# Altium schematic sheet CPU_PCB.SchDoc: CPU
size A4; Organization: FER; Address1: Unska 3; Address2: 10000 Zagreb; Address3: Croatia; SheetNumber: 3; SheetTotal: 4
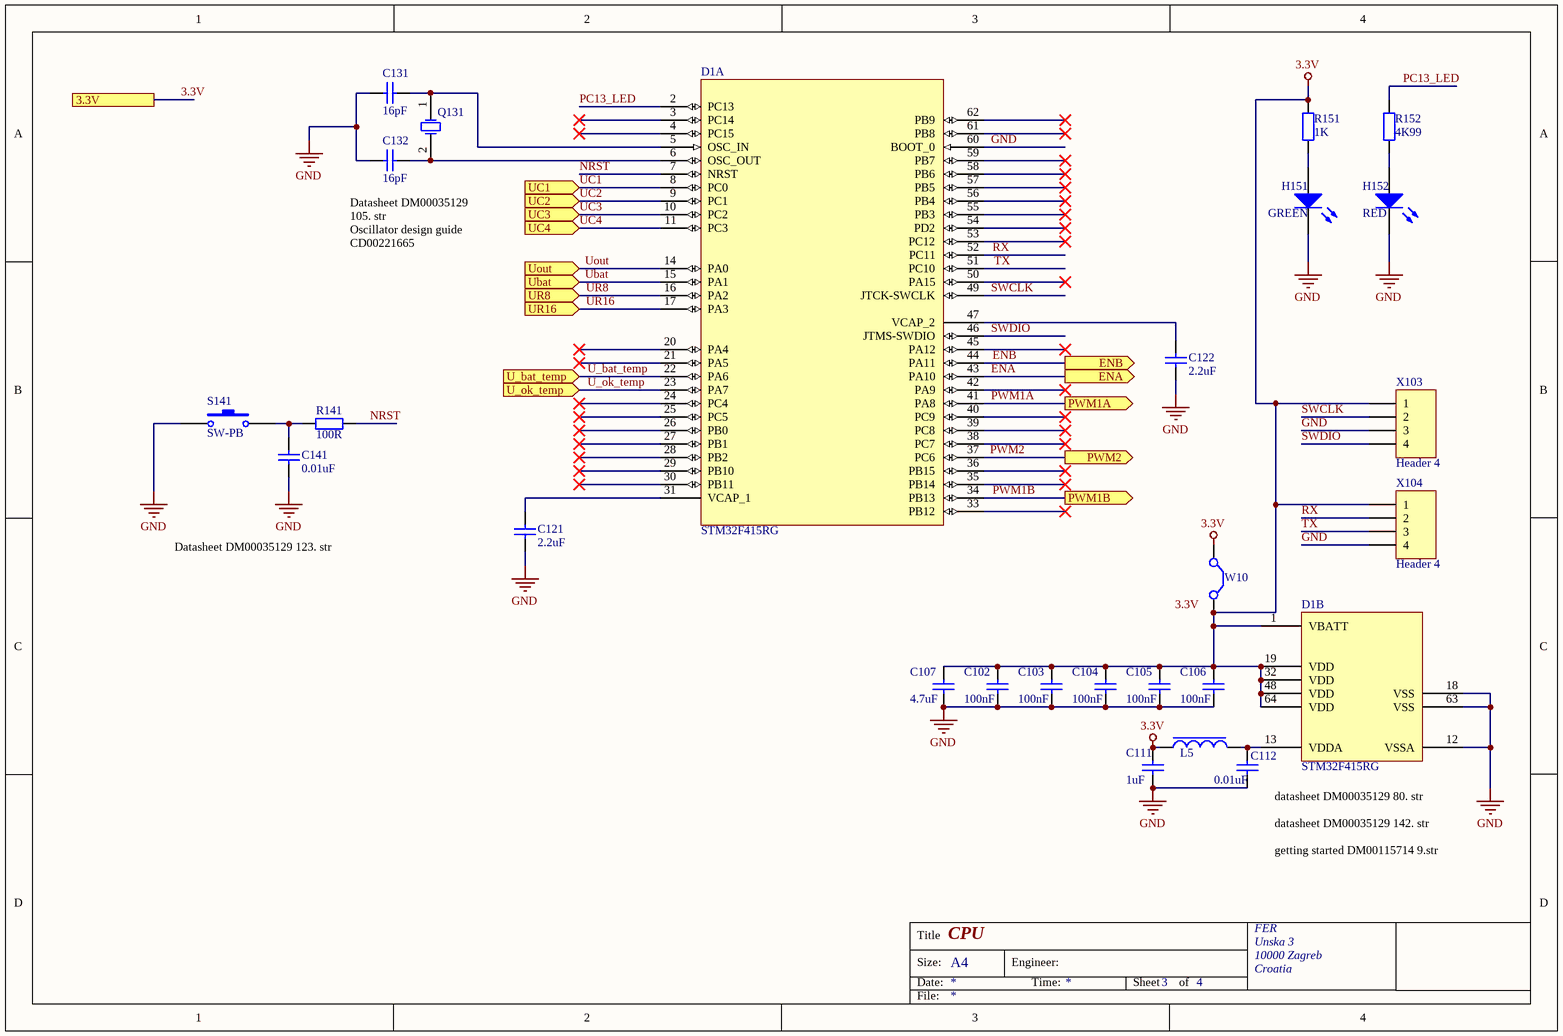
[diagram p0: CPU_PCB.SchDoc]

## Parts
C102  100nF  [CAP_0805]
C103  100nF  [CAP_0805]
C104  100nF  [CAP_0805]
C105  100nF  [CAP_0805]
C106  100nF  [CAP_0805]
C107  4.7uF  [CAP_0805]
C111  1uF  [CAP_0805]
C112  0.01uF  [CAP_0603]
C121  2.2uF  [CAP_0805]
C122  2.2uF  [CAP_0805]
C131  16pF  [CAP_0603]
C132  16pF  [CAP_0603]
C141  0.01uF  [CAP_0603]
D1  STM32F415RG  [LQFP64]  (parts A,B of 2)
H151  GREEN  [LED 1.25X2 SMD]
H152  RED  [LED 1.25X2 SMD]
L5  Inductor  [C0805]  (value not drawn)
Q131  XTAL  [QUARTZ_SMD_16MHZ]  (value not drawn)
R141  100R  [RES_0805]
R151  1K  [RES_0603]
R152  4K99  [RES_0805]
S141  SW-PB  [SWITCH KSEK43GLFS]
W10  Jumper  [HDR1X2]  (value not drawn)
X103  Header 4  [HEADER-4_PIN]
X104  Header 4  [HEADER-4_PIN]

## Ports
3.3V, ENA (out), ENB (out), PWM1A (out), PWM1B (out), PWM2 (out), U_bat_temp (in), U_ok_temp (in), Ubat (in), UC1 (in), UC2 (in), UC3 (in), UC4 (in), Uout (in), UR8 (in), UR16 (in)

## Nets
3.3V: C102.2 C103.2 C104.2 C105.2 C106.2 C107.2 C111.2 D1.1(VBATT) D1.19(VDD) D1.32(VDD) D1.48(VDD) D1.64(VDD) L5.1 R151.2 W10.1(C1) W10.2(C2) X103.1 X104.1 ; port 3.3V
GND: C102.1 C103.1 C104.1 C105.1 C106.1 C107.1 C111.1 C112.1 C121.1 C122.1 C131.2 C132.2 C141.1 D1.12(VSSA) D1.18(VSS) D1.60(BOOT_0) D1.63(VSS) H151.2(K) H152.2(K) S141.2 X103.3 X104.4
ENA: D1.43(PA10) ; port ENA
ENB: D1.44(PA11) ; port ENB
NRST: D1.7(NRST) R141.1
PC13_LED: D1.2(PC13) R152.2
PWM1A: D1.41(PA8) ; port PWM1A
PWM1B: D1.34(PB13) ; port PWM1B
PWM2: D1.37(PC6) ; port PWM2
RX: D1.52(PC11) X104.2
SWCLK: D1.49(JTCK-SWCLK) X103.2
SWDIO: D1.46(JTMS-SWDIO) X103.4
TX: D1.51(PC10) X104.3
U_bat_temp: D1.22(PA6) ; port U_bat_temp
U_ok_temp: D1.23(PA7) ; port U_ok_temp
Ubat: D1.15(PA1) ; port Ubat
UC1: D1.8(PC0) ; port UC1
UC2: D1.9(PC1) ; port UC2
UC3: D1.10(PC2) ; port UC3
UC4: D1.11(PC3) ; port UC4
Uout: D1.14(PA0) ; port Uout
UR8: D1.16(PA2) ; port UR8
UR16: D1.17(PA3) ; port UR16
NetC112_2: C112.2 D1.13(VDDA) L5.2
NetC121_2: C121.2 D1.31(VCAP_1)
NetC122_2: C122.2 D1.47(VCAP_2)
NetC131_1: C131.1 D1.5(OSC_IN) Q131.1(OSC1)
NetC132_1: C132.1 D1.6(OSC_OUT) Q131.2(OSC2)
NetC141_2: C141.2 R141.2 S141.1
NetH151_1: H151.1(A) R151.1
NetH152_1: H152.1(A) R152.1

Not connected (* = marked no-connect by the designer): D1 3(PC14)* 4(PC15)* 20(PA4)* 21(PA5)* 24(PC4)* 25(PC5)* 26(PB0)* 27(PB1)* 28(PB2)* 29(PB10)* 30(PB11)* 33(PB12)* 35(PB14)* 36(PB15)* 38(PC7)* 39(PC8)* 40(PC9)* 42(PA9)* 45(PA12)* 50(PA15)* 53(PC12)* 54(PD2)* 55(PB3)* 56(PB4)* 57(PB5)* 58(PB6)* 59(PB7)* 61(PB8)* 62(PB9)*

## Notes on the sheet
- (near C132) Datasheet DM00035129 105. str
  Oscillator design guide CD00221665
- Datasheet DM00035129 123. str
- datasheet DM00035129 80. str
  datasheet DM00035129 142. str
  getting started DM00115714 9.str
- Labels drawn without touching a wire or pin: 3.3V
- Title
- Size:
- Date:
- A4
- Engineer:
- Time:
- Sheet
- of
- File:

## Library data of the parts
C102-C106 = Cap: Capacitor; cijena (funte): 0.182; dobavljač: Farnell; kataloški broj: 1856515; opis komponente: Capacitor 100nF ceramic; Value: 100nF
C107 = Cap: Capacitor; cijena (funte): 0.61; dobavljač: Farnell; kataloški broj: 2346932; opis komponente: Capacitor 4.7uF ceramic; Value: 4.7uF
C111 = Cap: Capacitor; cijena (funte): 0.0507; dobavljač: Farnell; kataloški broj: 2496946; opis komponente: Capacitor 1uF ceramic; Value: 1uF
C112 C141 = Cap: Capacitor; cijena (funte): 0.0529; dobavljač: Farnell; kataloški broj: 1709948; opis komponente: Capacitor 0.01uF ceramic; Value: 0.01uF
C121 C122 = Cap: Capacitor; cijena (funte): 0.186; dobavljač: Farnell; kataloški broj: 1845751; opis komponente: Capacitor 2.2uF ceramic; Value: 2.2uF
C131 C132 = Cap: Capacitor; cijena (funte): 0.239; dobavljač: Farnell; kataloški broj: 1885400; opis komponente: Capacitor 16pF; Value: 16pF
D1 = STM32F415RG: Processor; cijena (funte): 7.87; dobavljač: Farnell; kataloški broj: 2064370; opis komponente: STM32F415RG
H151 = LED0: Typical INFRARED GaAs LED; cijena (funte): 0.0613; dobavljač: Farnell; kataloški broj: 2463991; opis komponente: LED diode GREEN; Value: Green
H152 = LED0: Typical INFRARED GaAs LED; cijena (funte): 0.259; dobavljač: Farnell; kataloški broj: 2610416; opis komponente: LED diode red; Value: Red
L5 = Inductor: cijena (funte): 0.0859; dobavljač: Farnell; kataloški broj: 2329422; opis komponente: ferrite bead
Q131 = XTAL: Crystal Oscillator; Value: 16MHz; cijena (funte): 0.535; dobavljač: Farnell; kataloški broj: 1611806; opis komponente: oscilator
R141 = Res2: Resistor; cijena (funte): 0.01; dobavljač: Farnell; kataloški broj: 9333703; opis komponente: Resistor 100R; Value: 100R
R151 = Res2: Resistor; cijena (funte): 0.0444; dobavljač: Farnell; kataloški broj: 1469740; opis komponente: Resistor 1K, 1%; Value: 1K
R152 = Res2: Resistor; cijena (funte): 0.56; dobavljač: Farnell; kataloški broj: 2094815; opis komponente: Resistor 4K99, 0.1%; Value: 4K99
S141 = SW-PB: Switch; cijena (funte): 0.159; dobavljač: Farnell; kataloški broj: 2435308
W10 = Jumper: Jumper Wire; cijena (funte): 0.0874; dobavljač: Farnell; kataloški broj: 2396303; opis komponente: jumper
X103 X104 = Header 4: Header, 4-Pin; dobavljač: Farnell; kataloški broj: 1022264; opis komponente: konektor